# EAGLE design BPW5023 Prototyping Wing (EAGLE 6.3)
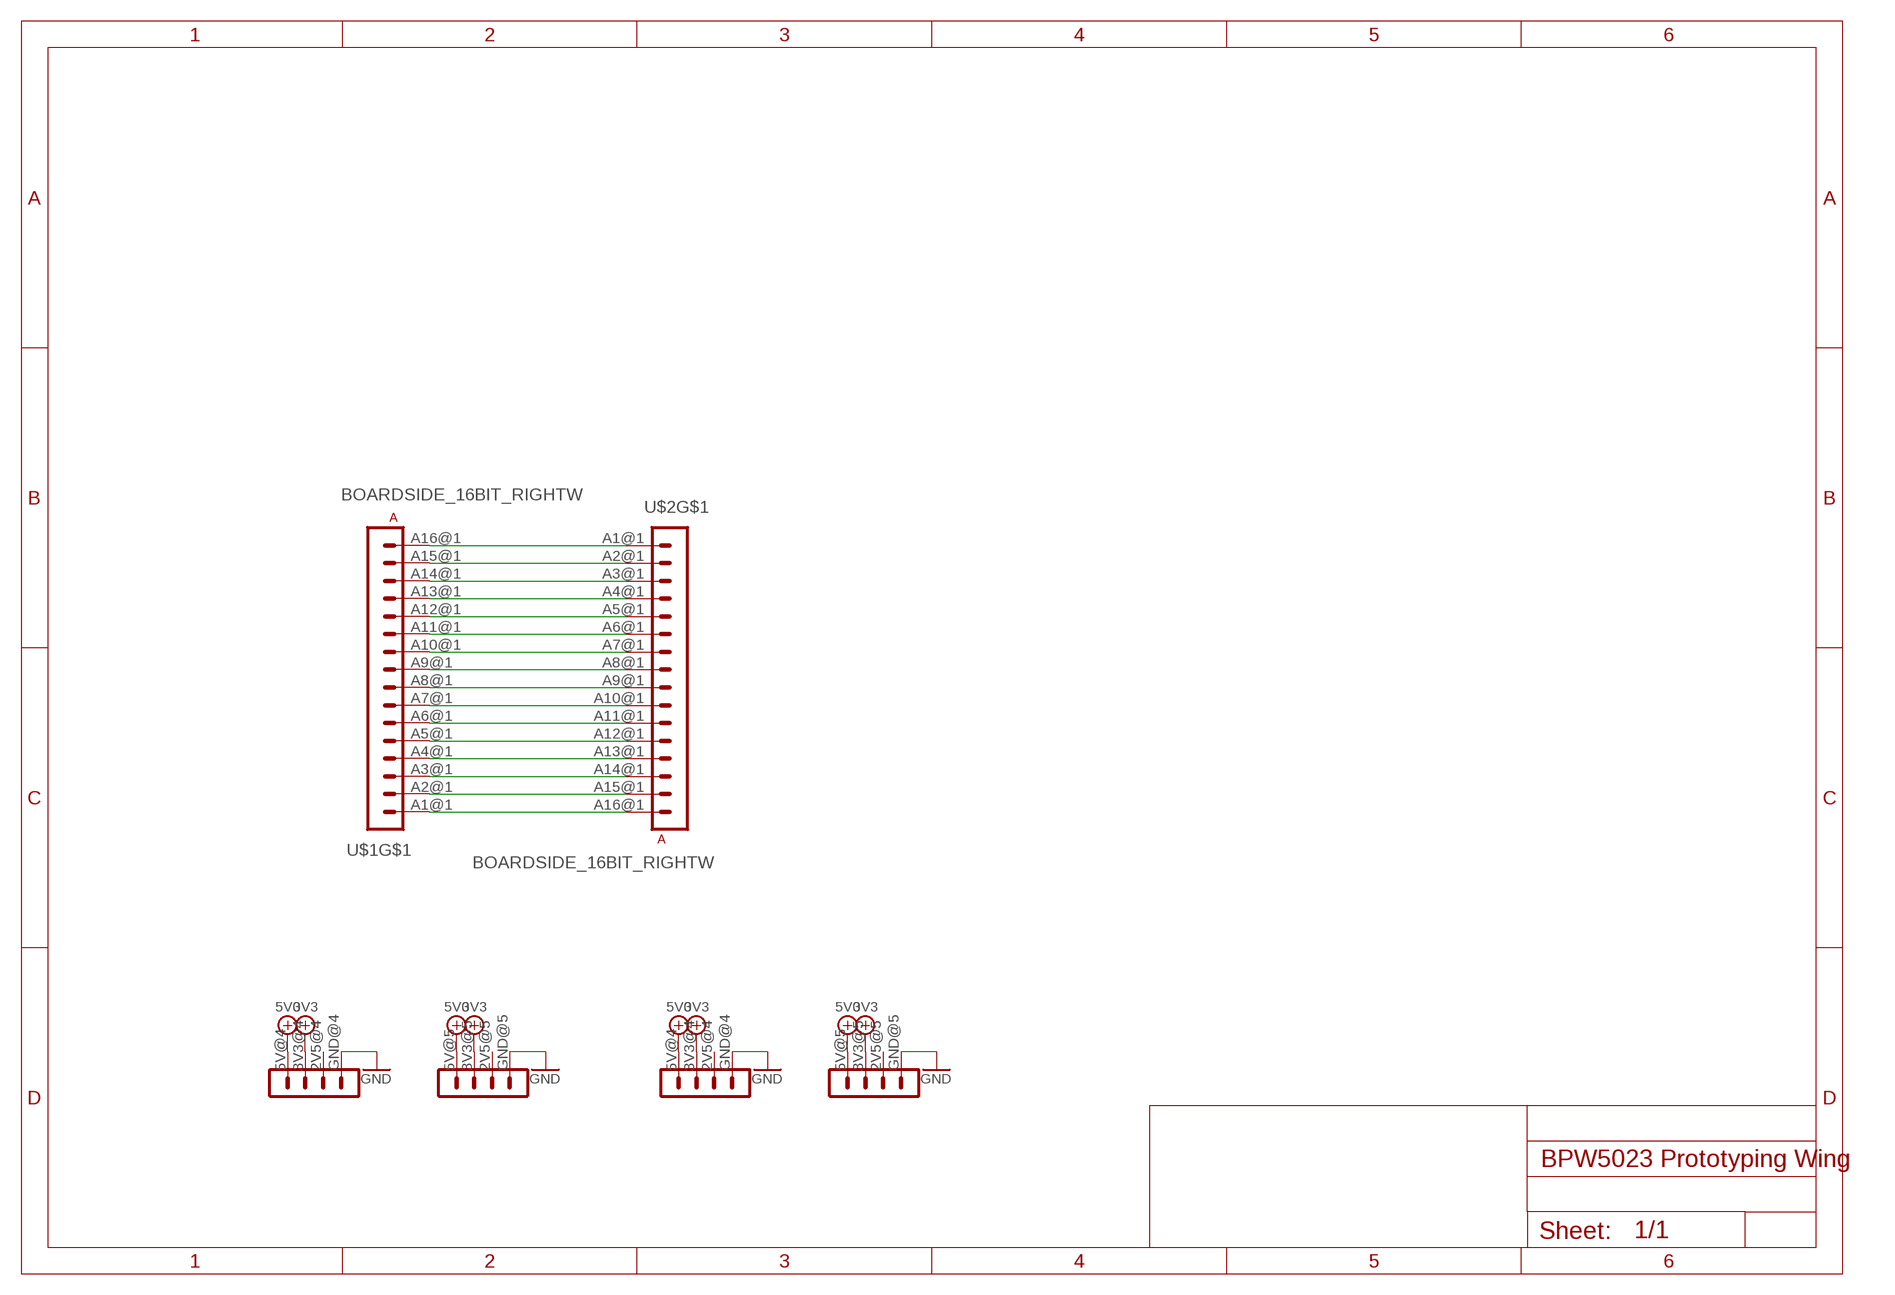
[diagram p0: schematic, sheet 1]

## Parts
U$1  BOARDSIDE_16BIT_RIGHTW  [COCOON_16BIT]
U$2  BOARDSIDE_16BIT_RIGHTW  [COCOON_16BIT]

## Nets
3V3: U$1.3V3@4(3V3) U$1.3V3@5(3V3) U$2.3V3@4(3V3) U$2.3V3@5(3V3)
5V0: U$1.5V@4(5V) U$1.5V@5(5V) U$2.5V@4(5V) U$2.5V@5(5V)
A1: U$1.A1@1(A1) U$2.A16@1(A16)
A2: U$1.A2@1(A2) U$2.A15@1(A15)
A3: U$1.A3@1(A3) U$2.A14@1(A14)
A4: U$1.A4@1(A4) U$2.A13@1(A13)
A5: U$1.A5@1(A5) U$2.A12@1(A12)
A6: U$1.A6@1(A6) U$2.A11@1(A11)
A7: U$1.A7@1(A7) U$2.A10@1(A10)
A8: U$1.A8@1(A8) U$2.A9@1(A9)
A9: U$1.A9@1(A9) U$2.A8@1(A8)
A10: U$1.A10@1(A10) U$2.A7@1(A7)
A11: U$1.A11@1(A11) U$2.A6@1(A6)
A12: U$1.A12@1(A12) U$2.A5@1(A5)
A13: U$1.A13@1(A13) U$2.A4@1(A4)
A14: U$1.A14@1(A14) U$2.A3@1(A3)
A15: U$1.A15@1(A15) U$2.A2@1(A2)
A16: U$1.A16@1(A16) U$2.A1@1(A1)
GND: U$1.GND@4(GND) U$1.GND@5(GND) U$2.GND@4(GND) U$2.GND@5(GND)
Unconnected: U$1.2V5@4(2V5) U$1.2V5@5(2V5) U$2.2V5@4(2V5) U$2.2V5@5(2V5)

## Library data of the parts
U$1 U$2 = GadgetFactory_Pub:BOARDSIDE_16BIT_RIGHT

## Board
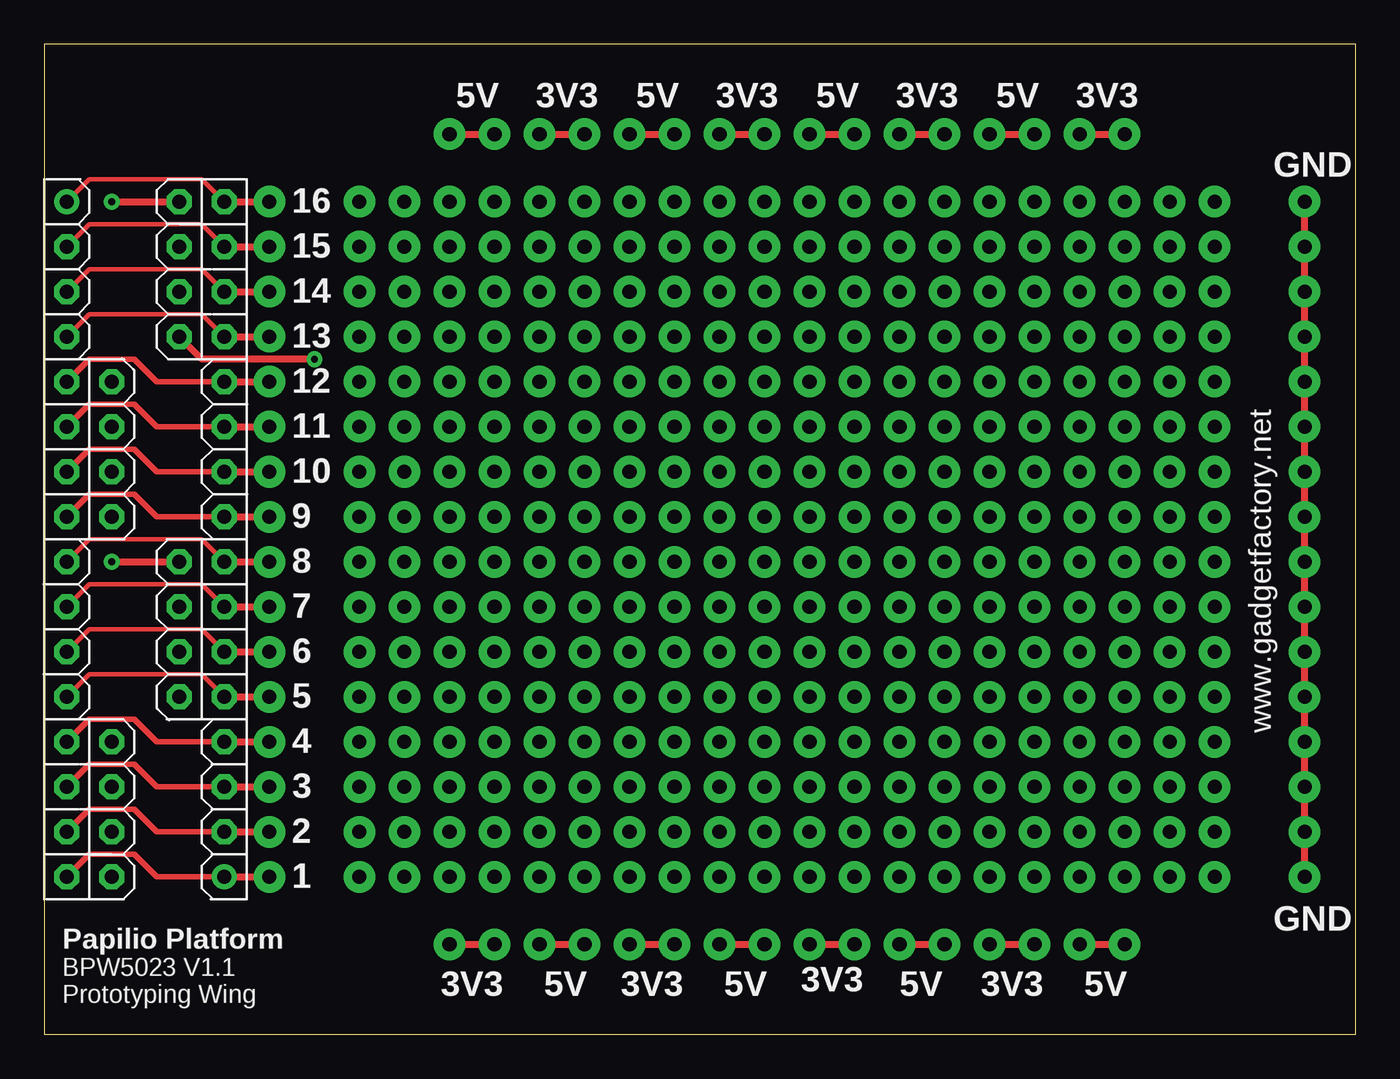
[diagram p1: board, top side]
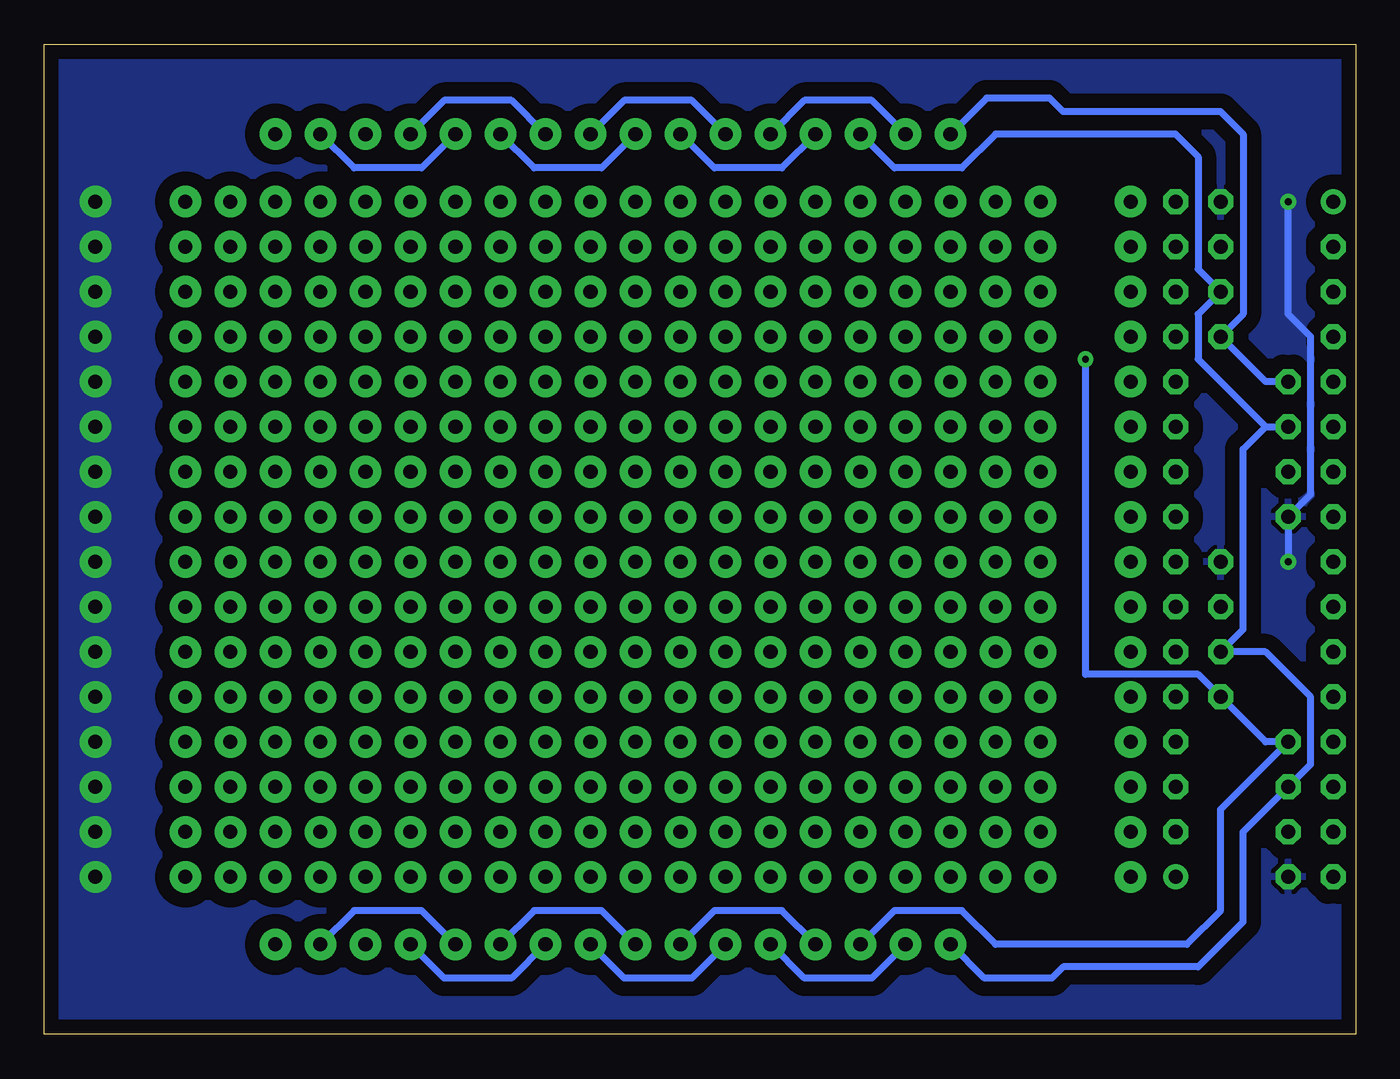
[diagram p2: board, bottom side, seen from below]

Size 74 x 55.87 mm. Coordinates in mm from the lower left corner, seen from the top.
Outline: 0,0 74,0 74,55.87 0,55.87 0,0
Copper layers (1*16): Top 0.035mm / dielectric 1.5mm / Bottom 0.035mm
Design rules "SparkFun_Derived_GoldePheonix_7mil": minimum track width 7mil, minimum drill 15mil, track to track 7mil, track to pad 7mil, pad to pad 7mil, via to via 7mil, smd to smd 7mil, copper to edge 7mil, drill to drill 7mil, minimum pad ring 12mil, minimum via ring 10mil, stop-mask expansion 4mil, vias tented up to drill 18mil, thermal gap 10mil

### Footprints (pad centres in the part's own frame; a part is rotated, then mirrored left to right if it is on the bottom)
COCOON_16BIT = drill 0.8 octagon: 2V5@4 3.81,-16.51; 2V5@5 3.81,3.81; 3V3@4 3.81,-13.97; 3V3@5 3.81,6.35; 5V@4 3.81,-11.43; 5V@5 3.81,8.89; A1@1 1.27,-19.05; A2@1 1.27,-16.51; A3@1 1.27,-13.97; A4@1 1.27,-11.43; A5@1 1.27,-8.89; A6@1 1.27,-6.35; A7@1 1.27,-3.81; A8@1 1.27,-1.27; A9@1 1.27,1.27; A10@1 1.27,3.81; A11@1 1.27,6.35; A12@1 1.27,8.89; A13@1 1.27,11.43; A14@1 1.27,13.97; A15@1 1.27,16.51; GND@4 3.81,-19.05; GND@5 3.81,1.27 | drill 0.8: A16@1 1.27,19.05

### Placement (x,y rotation side)
U$1  0,27.94 0 top
U$2  11.43,27.94 180 top

### Tracks (layer width: path | path; a pad name or v marks a point on that pad's centre or on a via)
3V3  (via drill 0.8 pad 1.78)
  Top 0.406: v58.42,50.8 v60.96,50.8 | v22.86,5.08 v25.4,5.08 | v33.02,5.08 v35.56,5.08 | v43.18,5.08 v45.72,5.08 | v53.34,5.08 v55.88,5.08 | v27.94,50.8 v30.48,50.8 | v38.1,50.8 v40.64,50.8 | v48.26,50.8 v50.8,50.8
  Bottom 0.406: v27.94,50.8 26.04,48.9 22.23,48.9 20.32,50.8 10.16,50.8 8.89,49.53 8.89,43.18 U$2.3V3@4 8.89,40.64 8.89,38.1 5.08,34.29 | v30.48,50.8 32.38,48.9 36.2,48.9 v38.1,50.8 | v40.64,50.8 42.55,48.9 46.35,48.9 v48.26,50.8 | v50.8,50.8 52.7,48.9 56.52,48.9 v58.42,50.8 | v22.86,5.08 20.95,3.17 17.14,3.17 16.51,3.81 8.89,3.81 6.35,6.35 6.35,11.43 U$1.3V3@4 2.54,15.24 2.54,19.05 5.08,21.59 U$2.3V3@5 6.35,22.86 6.35,33.02 5.08,34.29 | v25.4,5.08 27.3,3.17 31.11,3.17 v33.02,5.08 | v35.56,5.08 37.47,3.17 41.27,3.17 v43.18,5.08 | v45.72,5.08 47.62,3.17 51.44,3.17 v53.34,5.08 | 5.08,34.29 U$1.3V3@5
5V0  (via drill 0.38, 0.8 pad 1.78)
  Top 0.406: v22.86,50.8 v25.4,50.8 | v33.02,50.8 v35.56,50.8 | v43.18,50.8 v45.72,50.8 | v53.34,50.8 v55.88,50.8 | v38.1,5.08 v40.64,5.08 | v48.26,5.08 v50.8,5.08 | v58.42,5.08 v60.96,5.08 | v27.94,5.08 v30.48,5.08 | v15.24,38.1 8.89,38.1 U$2.5V@4
  Bottom 0.406: v22.86,50.8 20.83,52.83 17.27,52.83 16.51,52.07 7.62,52.07 6.35,50.8 6.35,40.64 U$2.5V@4 5.08,36.83 U$1.5V@5 | v25.4,50.8 27.3,52.7 31.11,52.7 v33.02,50.8 | v35.56,50.8 37.47,52.7 41.27,52.7 v43.18,50.8 | v45.72,50.8 47.62,52.7 51.44,52.7 v53.34,50.8 | v27.94,5.08 26.04,6.99 22.23,6.99 20.32,5.08 9.53,5.08 7.62,6.99 7.62,12.7 U$1.5V@4 5.08,16.51 U$2.5V@5 8.89,20.32 15.24,20.32 v15.24,38.1 | v30.48,5.08 32.38,6.99 36.2,6.99 v38.1,5.08 | v40.64,5.08 42.55,6.99 46.35,6.99 v48.26,5.08 | v50.8,5.08 52.7,6.99 56.52,6.99 v58.42,5.08
A1  (via drill 0.8 pad 1.78)
  Top 0.305: U$1.A1@1 2.54,10.16 5.08,10.16 6.35,8.89 U$2.A16@1
  Top 0.406: U$2.A16@1 v12.7,8.89
A2  (via drill 0.8 pad 1.78)
  Top 0.305: U$2.A15@1 6.35,11.43 5.08,12.7 2.54,12.7 U$1.A2@1
  Top 0.406: U$2.A15@1 v12.7,11.43
A3  (via drill 0.8 pad 1.78)
  Top 0.305: U$2.A14@1 6.35,13.97 5.08,15.24 2.54,15.24 U$1.A3@1
  Top 0.406: U$2.A14@1 v12.7,13.97
A4  (via drill 0.8 pad 1.78)
  Top 0.305: U$2.A13@1 6.35,16.51 5.08,17.78 2.54,17.78 U$1.A4@1
  Top 0.406: U$2.A13@1 v12.7,16.51
A5  (via drill 0.8 pad 1.78)
  Top 0.254: U$1.A5@1 2.54,20.32 8.89,20.32 U$2.A12@1
  Top 0.406: U$2.A12@1 v12.7,19.05
A6  (via drill 0.8 pad 1.78)
  Top 0.254: U$1.A6@1 2.54,22.86 8.89,22.86 U$2.A11@1
  Top 0.406: U$2.A11@1 v12.7,21.59
A7  (via drill 0.8 pad 1.78)
  Top 0.254: U$1.A7@1 2.54,25.4 8.89,25.4 U$2.A10@1
  Top 0.406: U$2.A10@1 v12.7,24.13
A8  (via drill 0.8 pad 1.78)
  Top 0.254: U$1.A8@1 2.54,27.94 8.89,27.94 U$2.A9@1
  Top 0.406: U$2.A9@1 v12.7,26.67
A9  (via drill 0.8 pad 1.78)
  Top 0.305: U$1.A9@1 2.54,30.48 5.08,30.48 6.35,29.21 U$2.A8@1
  Top 0.406: U$2.A8@1 v12.7,29.21
A10  (via drill 0.8 pad 1.78)
  Top 0.305: U$2.A7@1 6.35,31.75 5.08,33.02 2.54,33.02 U$1.A10@1
  Top 0.406: U$2.A7@1 v12.7,31.75
A11  (via drill 0.8 pad 1.78)
  Top 0.305: U$2.A6@1 6.35,34.29 5.08,35.56 2.54,35.56 U$1.A11@1
  Top 0.406: U$2.A6@1 v12.7,34.29
A12  (via drill 0.8 pad 1.78)
  Top 0.305: U$2.A5@1 6.35,36.83 5.08,38.1 2.54,38.1 U$1.A12@1
  Top 0.406: U$2.A5@1 v12.7,36.83
A13  (via drill 0.8 pad 1.78)
  Top 0.254: U$1.A13@1 2.54,40.64 8.89,40.64 U$2.A4@1
  Top 0.406: U$2.A4@1 v12.7,39.37
A14  (via drill 0.8 pad 1.78)
  Top 0.254: U$1.A14@1 2.54,43.18 8.89,43.18 U$2.A3@1
  Top 0.406: U$2.A3@1 v12.7,41.91
A15  (via drill 0.8 pad 1.78)
  Top 0.254: U$1.A15@1 2.54,45.72 8.89,45.72 U$2.A2@1
  Top 0.406: U$2.A2@1 v12.7,44.45
A16  (via drill 0.8 pad 1.78)
  Top 0.254: U$1.A16@1 2.54,48.26 8.89,48.26 U$2.A1@1
  Top 0.406: U$2.A1@1 v12.7,46.99
GND  (via drill 0.38, 0.8 pad 1.78)
  Top 0.406: v71.12,46.99 v71.12,44.45 v71.12,41.91 v71.12,39.37 v71.12,36.83 v71.12,34.29 v71.12,31.75 v71.12,29.21 v71.12,26.67 v71.12,24.13 v71.12,21.59 v71.12,19.05 v71.12,16.51 v71.12,13.97 v71.12,11.43 v71.12,8.89 | v3.81,46.99 U$2.GND@4 | v3.81,26.67 U$2.GND@5
  Bottom 0.406: v3.81,46.99 3.81,40.64 2.54,39.37 2.54,30.48 U$1.GND@5 v3.81,26.67
  pour Bottom (isolate 0.813): 0,55.88 73.66,55.88 73.66,0 0,0
N$1  (via drill 0.8 pad 1.78)
  other vias: 17.78,8.89
N$2  (via drill 0.8 pad 1.78)
  other vias: 20.32,8.89
N$3  (via drill 0.8 pad 1.78)
  other vias: 22.86,8.89
N$4  (via drill 0.8 pad 1.78)
  other vias: 25.4,8.89
N$5  (via drill 0.8 pad 1.78)
  other vias: 27.94,8.89
N$6  (via drill 0.8 pad 1.78)
  other vias: 30.48,8.89
N$7  (via drill 0.8 pad 1.78)
  other vias: 33.02,8.89
N$8  (via drill 0.8 pad 1.78)
  other vias: 35.56,8.89
N$9  (via drill 0.8 pad 1.78)
  other vias: 38.1,8.89
N$10  (via drill 0.8 pad 1.78)
  other vias: 40.64,8.89
N$11  (via drill 0.8 pad 1.78)
  other vias: 17.78,11.43
N$12  (via drill 0.8 pad 1.78)
  other vias: 20.32,11.43
N$13  (via drill 0.8 pad 1.78)
  other vias: 22.86,11.43
N$14  (via drill 0.8 pad 1.78)
  other vias: 25.4,11.43
N$15  (via drill 0.8 pad 1.78)
  other vias: 27.94,11.43
N$16  (via drill 0.8 pad 1.78)
  other vias: 30.48,11.43
N$17  (via drill 0.8 pad 1.78)
  other vias: 33.02,11.43
N$18  (via drill 0.8 pad 1.78)
  other vias: 35.56,11.43
N$19  (via drill 0.8 pad 1.78)
  other vias: 38.1,11.43
N$20  (via drill 0.8 pad 1.78)
  other vias: 40.64,11.43
N$21  (via drill 0.8 pad 1.78)
  other vias: 40.64,13.97
N$22  (via drill 0.8 pad 1.78)
  other vias: 38.1,13.97
N$23  (via drill 0.8 pad 1.78)
  other vias: 35.56,13.97
N$24  (via drill 0.8 pad 1.78)
  other vias: 33.02,13.97
N$25  (via drill 0.8 pad 1.78)
  other vias: 30.48,13.97
N$26  (via drill 0.8 pad 1.78)
  other vias: 27.94,13.97
N$27  (via drill 0.8 pad 1.78)
  other vias: 25.4,13.97
N$28  (via drill 0.8 pad 1.78)
  other vias: 22.86,13.97
N$29  (via drill 0.8 pad 1.78)
  other vias: 20.32,13.97
N$30  (via drill 0.8 pad 1.78)
  other vias: 17.78,13.97
N$31  (via drill 0.8 pad 1.78)
  other vias: 17.78,16.51
N$32  (via drill 0.8 pad 1.78)
  other vias: 20.32,16.51
N$33  (via drill 0.8 pad 1.78)
  other vias: 22.86,16.51
N$34  (via drill 0.8 pad 1.78)
  other vias: 25.4,16.51
N$35  (via drill 0.8 pad 1.78)
  other vias: 27.94,16.51
N$36  (via drill 0.8 pad 1.78)
  other vias: 30.48,16.51
N$37  (via drill 0.8 pad 1.78)
  other vias: 33.02,16.51
N$38  (via drill 0.8 pad 1.78)
  other vias: 35.56,16.51
N$39  (via drill 0.8 pad 1.78)
  other vias: 38.1,16.51
N$40  (via drill 0.8 pad 1.78)
  other vias: 40.64,16.51
N$41  (via drill 0.8 pad 1.78)
  other vias: 40.64,19.05
N$42  (via drill 0.8 pad 1.78)
  other vias: 38.1,19.05
N$43  (via drill 0.8 pad 1.78)
  other vias: 35.56,19.05
N$44  (via drill 0.8 pad 1.78)
  other vias: 33.02,19.05
N$45  (via drill 0.8 pad 1.78)
  other vias: 30.48,19.05
N$46  (via drill 0.8 pad 1.78)
  other vias: 27.94,19.05
N$47  (via drill 0.8 pad 1.78)
  other vias: 25.4,19.05
N$48  (via drill 0.8 pad 1.78)
  other vias: 22.86,19.05
N$49  (via drill 0.8 pad 1.78)
  other vias: 20.32,19.05
N$50  (via drill 0.8 pad 1.78)
  other vias: 17.78,19.05
N$51  (via drill 0.8 pad 1.78)
  other vias: 17.78,21.59
N$52  (via drill 0.8 pad 1.78)
  other vias: 20.32,21.59
N$53  (via drill 0.8 pad 1.78)
  other vias: 22.86,21.59
N$54  (via drill 0.8 pad 1.78)
  other vias: 25.4,21.59
N$55  (via drill 0.8 pad 1.78)
  other vias: 27.94,21.59
N$56  (via drill 0.8 pad 1.78)
  other vias: 30.48,21.59
N$57  (via drill 0.8 pad 1.78)
  other vias: 33.02,21.59
N$58  (via drill 0.8 pad 1.78)
  other vias: 35.56,21.59
N$59  (via drill 0.8 pad 1.78)
  other vias: 38.1,21.59
N$60  (via drill 0.8 pad 1.78)
  other vias: 40.64,21.59
N$61  (via drill 0.8 pad 1.78)
  other vias: 40.64,24.13
N$62  (via drill 0.8 pad 1.78)
  other vias: 38.1,24.13
N$63  (via drill 0.8 pad 1.78)
  other vias: 35.56,24.13
N$64  (via drill 0.8 pad 1.78)
  other vias: 33.02,24.13
N$65  (via drill 0.8 pad 1.78)
  other vias: 30.48,24.13
N$66  (via drill 0.8 pad 1.78)
  other vias: 27.94,24.13
N$67  (via drill 0.8 pad 1.78)
  other vias: 25.4,24.13
N$68  (via drill 0.8 pad 1.78)
  other vias: 22.86,24.13
N$69  (via drill 0.8 pad 1.78)
  other vias: 20.32,24.13
N$70  (via drill 0.8 pad 1.78)
  other vias: 17.78,24.13
N$71  (via drill 0.8 pad 1.78)
  other vias: 17.78,26.67
N$72  (via drill 0.8 pad 1.78)
  other vias: 20.32,26.67
N$73  (via drill 0.8 pad 1.78)
  other vias: 22.86,26.67
N$74  (via drill 0.8 pad 1.78)
  other vias: 25.4,26.67
N$75  (via drill 0.8 pad 1.78)
  other vias: 27.94,26.67
N$76  (via drill 0.8 pad 1.78)
  other vias: 30.48,26.67
N$77  (via drill 0.8 pad 1.78)
  other vias: 33.02,26.67
N$78  (via drill 0.8 pad 1.78)
  other vias: 35.56,26.67
N$79  (via drill 0.8 pad 1.78)
  other vias: 38.1,26.67
N$80  (via drill 0.8 pad 1.78)
  other vias: 40.64,26.67
N$81  (via drill 0.8 pad 1.78)
  other vias: 40.64,29.21
N$82  (via drill 0.8 pad 1.78)
  other vias: 38.1,29.21
N$83  (via drill 0.8 pad 1.78)
  other vias: 35.56,29.21
N$84  (via drill 0.8 pad 1.78)
  other vias: 33.02,29.21
N$85  (via drill 0.8 pad 1.78)
  other vias: 30.48,29.21
N$86  (via drill 0.8 pad 1.78)
  other vias: 27.94,29.21
N$87  (via drill 0.8 pad 1.78)
  other vias: 25.4,29.21
N$88  (via drill 0.8 pad 1.78)
  other vias: 22.86,29.21
N$89  (via drill 0.8 pad 1.78)
  other vias: 20.32,29.21
N$90  (via drill 0.8 pad 1.78)
  other vias: 17.78,29.21
N$91  (via drill 0.8 pad 1.78)
  other vias: 17.78,31.75
N$92  (via drill 0.8 pad 1.78)
  other vias: 20.32,31.75
N$93  (via drill 0.8 pad 1.78)
  other vias: 22.86,31.75
N$94  (via drill 0.8 pad 1.78)
  other vias: 25.4,31.75
N$95  (via drill 0.8 pad 1.78)
  other vias: 27.94,31.75
N$96  (via drill 0.8 pad 1.78)
  other vias: 30.48,31.75
N$97  (via drill 0.8 pad 1.78)
  other vias: 33.02,31.75
N$98  (via drill 0.8 pad 1.78)
  other vias: 35.56,31.75
N$99  (via drill 0.8 pad 1.78)
  other vias: 38.1,31.75
N$100  (via drill 0.8 pad 1.78)
  other vias: 40.64,31.75
N$101  (via drill 0.8 pad 1.78)
  other vias: 40.64,34.29
N$102  (via drill 0.8 pad 1.78)
  other vias: 38.1,34.29
N$103  (via drill 0.8 pad 1.78)
  other vias: 35.56,34.29
N$104  (via drill 0.8 pad 1.78)
  other vias: 33.02,34.29
N$105  (via drill 0.8 pad 1.78)
  other vias: 30.48,34.29
N$106  (via drill 0.8 pad 1.78)
  other vias: 27.94,34.29
N$107  (via drill 0.8 pad 1.78)
  other vias: 25.4,34.29
N$108  (via drill 0.8 pad 1.78)
  other vias: 22.86,34.29
N$109  (via drill 0.8 pad 1.78)
  other vias: 20.32,34.29
N$110  (via drill 0.8 pad 1.78)
  other vias: 17.78,34.29
N$111  (via drill 0.8 pad 1.78)
  other vias: 17.78,36.83
N$112  (via drill 0.8 pad 1.78)
  other vias: 20.32,36.83
N$113  (via drill 0.8 pad 1.78)
  other vias: 22.86,36.83
N$114  (via drill 0.8 pad 1.78)
  other vias: 25.4,36.83
N$115  (via drill 0.8 pad 1.78)
  other vias: 27.94,36.83
N$116  (via drill 0.8 pad 1.78)
  other vias: 30.48,36.83
N$117  (via drill 0.8 pad 1.78)
  other vias: 33.02,36.83
N$118  (via drill 0.8 pad 1.78)
  other vias: 35.56,36.83
N$119  (via drill 0.8 pad 1.78)
  other vias: 38.1,36.83
N$120  (via drill 0.8 pad 1.78)
  other vias: 40.64,36.83
N$121  (via drill 0.8 pad 1.78)
  other vias: 40.64,39.37
N$122  (via drill 0.8 pad 1.78)
  other vias: 38.1,39.37
N$123  (via drill 0.8 pad 1.78)
  other vias: 35.56,39.37
N$124  (via drill 0.8 pad 1.78)
  other vias: 33.02,39.37
N$125  (via drill 0.8 pad 1.78)
  other vias: 30.48,39.37
N$126  (via drill 0.8 pad 1.78)
  other vias: 27.94,39.37
N$127  (via drill 0.8 pad 1.78)
  other vias: 25.4,39.37
N$128  (via drill 0.8 pad 1.78)
  other vias: 22.86,39.37
N$129  (via drill 0.8 pad 1.78)
  other vias: 20.32,39.37
N$130  (via drill 0.8 pad 1.78)
  other vias: 17.78,39.37
N$131  (via drill 0.8 pad 1.78)
  other vias: 17.78,41.91
N$132  (via drill 0.8 pad 1.78)
  other vias: 20.32,41.91
N$133  (via drill 0.8 pad 1.78)
  other vias: 22.86,41.91
N$134  (via drill 0.8 pad 1.78)
  other vias: 25.4,41.91
N$135  (via drill 0.8 pad 1.78)
  other vias: 27.94,41.91
N$136  (via drill 0.8 pad 1.78)
  other vias: 30.48,41.91
N$137  (via drill 0.8 pad 1.78)
  other vias: 33.02,41.91
N$138  (via drill 0.8 pad 1.78)
  other vias: 35.56,41.91
N$139  (via drill 0.8 pad 1.78)
  other vias: 38.1,41.91
N$140  (via drill 0.8 pad 1.78)
  other vias: 40.64,41.91
N$141  (via drill 0.8 pad 1.78)
  other vias: 40.64,44.45
N$142  (via drill 0.8 pad 1.78)
  other vias: 38.1,44.45
N$143  (via drill 0.8 pad 1.78)
  other vias: 35.56,44.45
N$144  (via drill 0.8 pad 1.78)
  other vias: 33.02,44.45
N$145  (via drill 0.8 pad 1.78)
  other vias: 30.48,44.45
N$146  (via drill 0.8 pad 1.78)
  other vias: 27.94,44.45
N$147  (via drill 0.8 pad 1.78)
  other vias: 25.4,44.45
N$148  (via drill 0.8 pad 1.78)
  other vias: 22.86,44.45
N$149  (via drill 0.8 pad 1.78)
  other vias: 20.32,44.45
N$150  (via drill 0.8 pad 1.78)
  other vias: 17.78,44.45
N$151  (via drill 0.8 pad 1.78)
  other vias: 17.78,46.99
N$152  (via drill 0.8 pad 1.78)
  other vias: 20.32,46.99
N$153  (via drill 0.8 pad 1.78)
  other vias: 22.86,46.99
N$154  (via drill 0.8 pad 1.78)
  other vias: 25.4,46.99
N$155  (via drill 0.8 pad 1.78)
  other vias: 27.94,46.99
N$156  (via drill 0.8 pad 1.78)
  other vias: 30.48,46.99
N$157  (via drill 0.8 pad 1.78)
  other vias: 33.02,46.99
N$158  (via drill 0.8 pad 1.78)
  other vias: 35.56,46.99
N$159  (via drill 0.8 pad 1.78)
  other vias: 38.1,46.99
N$160  (via drill 0.8 pad 1.78)
  other vias: 40.64,46.99
N$171  (via drill 0.8 pad 1.78)
  other vias: 43.18,8.89
N$172  (via drill 0.8 pad 1.78)
  other vias: 45.72,8.89
N$173  (via drill 0.8 pad 1.78)
  other vias: 48.26,8.89
N$174  (via drill 0.8 pad 1.78)
  other vias: 50.8,8.89
N$175  (via drill 0.8 pad 1.78)
  other vias: 53.34,8.89
N$176  (via drill 0.8 pad 1.78)
  other vias: 55.88,8.89
N$177  (via drill 0.8 pad 1.78)
  other vias: 58.42,8.89
N$178  (via drill 0.8 pad 1.78)
  other vias: 60.96,8.89
N$179  (via drill 0.8 pad 1.78)
  other vias: 63.5,8.89
N$180  (via drill 0.8 pad 1.78)
  other vias: 66.04,8.89
N$181  (via drill 0.8 pad 1.78)
  other vias: 43.18,11.43
N$182  (via drill 0.8 pad 1.78)
  other vias: 45.72,11.43
N$183  (via drill 0.8 pad 1.78)
  other vias: 48.26,11.43
N$184  (via drill 0.8 pad 1.78)
  other vias: 50.8,11.43
N$185  (via drill 0.8 pad 1.78)
  other vias: 53.34,11.43
N$186  (via drill 0.8 pad 1.78)
  other vias: 55.88,11.43
N$187  (via drill 0.8 pad 1.78)
  other vias: 58.42,11.43
N$188  (via drill 0.8 pad 1.78)
  other vias: 60.96,11.43
N$189  (via drill 0.8 pad 1.78)
  other vias: 63.5,11.43
N$190  (via drill 0.8 pad 1.78)
  other vias: 66.04,11.43
N$191  (via drill 0.8 pad 1.78)
  other vias: 66.04,13.97
N$192  (via drill 0.8 pad 1.78)
  other vias: 63.5,13.97
N$193  (via drill 0.8 pad 1.78)
  other vias: 60.96,13.97
N$194  (via drill 0.8 pad 1.78)
  other vias: 58.42,13.97
N$195  (via drill 0.8 pad 1.78)
  other vias: 55.88,13.97
N$196  (via drill 0.8 pad 1.78)
  other vias: 53.34,13.97
N$197  (via drill 0.8 pad 1.78)
  other vias: 50.8,13.97
N$198  (via drill 0.8 pad 1.78)
  other vias: 48.26,13.97
N$199  (via drill 0.8 pad 1.78)
  other vias: 45.72,13.97
N$200  (via drill 0.8 pad 1.78)
  other vias: 43.18,13.97
N$201  (via drill 0.8 pad 1.78)
  other vias: 43.18,16.51
N$202  (via drill 0.8 pad 1.78)
  other vias: 45.72,16.51
N$203  (via drill 0.8 pad 1.78)
  other vias: 48.26,16.51
N$204  (via drill 0.8 pad 1.78)
  other vias: 50.8,16.51
N$205  (via drill 0.8 pad 1.78)
  other vias: 53.34,16.51
N$206  (via drill 0.8 pad 1.78)
  other vias: 55.88,16.51
N$207  (via drill 0.8 pad 1.78)
  other vias: 58.42,16.51
N$208  (via drill 0.8 pad 1.78)
  other vias: 60.96,16.51
N$209  (via drill 0.8 pad 1.78)
  other vias: 63.5,16.51
N$210  (via drill 0.8 pad 1.78)
  other vias: 66.04,16.51
N$211  (via drill 0.8 pad 1.78)
  other vias: 66.04,19.05
N$212  (via drill 0.8 pad 1.78)
  other vias: 63.5,19.05
N$213  (via drill 0.8 pad 1.78)
  other vias: 60.96,19.05
N$214  (via drill 0.8 pad 1.78)
  other vias: 58.42,19.05
N$215  (via drill 0.8 pad 1.78)
  other vias: 55.88,19.05
N$216  (via drill 0.8 pad 1.78)
  other vias: 53.34,19.05
N$217  (via drill 0.8 pad 1.78)
  other vias: 50.8,19.05
N$218  (via drill 0.8 pad 1.78)
  other vias: 48.26,19.05
N$219  (via drill 0.8 pad 1.78)
  other vias: 45.72,19.05
N$220  (via drill 0.8 pad 1.78)
  other vias: 43.18,19.05
N$221  (via drill 0.8 pad 1.78)
  other vias: 43.18,21.59
N$222  (via drill 0.8 pad 1.78)
  other vias: 45.72,21.59
N$223  (via drill 0.8 pad 1.78)
  other vias: 48.26,21.59
N$224  (via drill 0.8 pad 1.78)
  other vias: 50.8,21.59
N$225  (via drill 0.8 pad 1.78)
  other vias: 53.34,21.59
N$226  (via drill 0.8 pad 1.78)
  other vias: 55.88,21.59
N$227  (via drill 0.8 pad 1.78)
  other vias: 58.42,21.59
N$228  (via drill 0.8 pad 1.78)
  other vias: 60.96,21.59
N$229  (via drill 0.8 pad 1.78)
  other vias: 63.5,21.59
N$230  (via drill 0.8 pad 1.78)
  other vias: 66.04,21.59
N$231  (via drill 0.8 pad 1.78)
  other vias: 66.04,24.13
N$232  (via drill 0.8 pad 1.78)
  other vias: 63.5,24.13
N$233  (via drill 0.8 pad 1.78)
  other vias: 60.96,24.13
N$234  (via drill 0.8 pad 1.78)
  other vias: 58.42,24.13
N$235  (via drill 0.8 pad 1.78)
  other vias: 55.88,24.13
N$236  (via drill 0.8 pad 1.78)
  other vias: 53.34,24.13
N$237  (via drill 0.8 pad 1.78)
  other vias: 50.8,24.13
N$238  (via drill 0.8 pad 1.78)
  other vias: 48.26,24.13
N$239  (via drill 0.8 pad 1.78)
  other vias: 45.72,24.13
N$240  (via drill 0.8 pad 1.78)
  other vias: 43.18,24.13
N$241  (via drill 0.8 pad 1.78)
  other vias: 43.18,26.67
N$242  (via drill 0.8 pad 1.78)
  other vias: 45.72,26.67
N$243  (via drill 0.8 pad 1.78)
  other vias: 48.26,26.67
N$244  (via drill 0.8 pad 1.78)
  other vias: 50.8,26.67
N$245  (via drill 0.8 pad 1.78)
  other vias: 53.34,26.67
N$246  (via drill 0.8 pad 1.78)
  other vias: 55.88,26.67
N$247  (via drill 0.8 pad 1.78)
  other vias: 58.42,26.67
N$248  (via drill 0.8 pad 1.78)
  other vias: 60.96,26.67
N$249  (via drill 0.8 pad 1.78)
  other vias: 63.5,26.67
N$250  (via drill 0.8 pad 1.78)
  other vias: 66.04,26.67
N$251  (via drill 0.8 pad 1.78)
  other vias: 66.04,29.21
N$252  (via drill 0.8 pad 1.78)
  other vias: 63.5,29.21
N$253  (via drill 0.8 pad 1.78)
  other vias: 60.96,29.21
N$254  (via drill 0.8 pad 1.78)
  other vias: 58.42,29.21
N$255  (via drill 0.8 pad 1.78)
  other vias: 55.88,29.21
N$256  (via drill 0.8 pad 1.78)
  other vias: 53.34,29.21
N$257  (via drill 0.8 pad 1.78)
  other vias: 50.8,29.21
N$258  (via drill 0.8 pad 1.78)
  other vias: 48.26,29.21
N$259  (via drill 0.8 pad 1.78)
  other vias: 45.72,29.21
N$260  (via drill 0.8 pad 1.78)
  other vias: 43.18,29.21
N$261  (via drill 0.8 pad 1.78)
  other vias: 43.18,31.75
N$262  (via drill 0.8 pad 1.78)
  other vias: 45.72,31.75
N$263  (via drill 0.8 pad 1.78)
  other vias: 48.26,31.75
N$264  (via drill 0.8 pad 1.78)
  other vias: 50.8,31.75
N$265  (via drill 0.8 pad 1.78)
  other vias: 53.34,31.75
N$266  (via drill 0.8 pad 1.78)
  other vias: 55.88,31.75
N$267  (via drill 0.8 pad 1.78)
  other vias: 58.42,31.75
N$268  (via drill 0.8 pad 1.78)
  other vias: 60.96,31.75
N$269  (via drill 0.8 pad 1.78)
  other vias: 63.5,31.75
N$270  (via drill 0.8 pad 1.78)
  other vias: 66.04,31.75
N$271  (via drill 0.8 pad 1.78)
  other vias: 66.04,34.29
N$272  (via drill 0.8 pad 1.78)
  other vias: 63.5,34.29
N$273  (via drill 0.8 pad 1.78)
  other vias: 60.96,34.29
N$274  (via drill 0.8 pad 1.78)
  other vias: 58.42,34.29
N$275  (via drill 0.8 pad 1.78)
  other vias: 55.88,34.29
N$276  (via drill 0.8 pad 1.78)
  other vias: 53.34,34.29
N$277  (via drill 0.8 pad 1.78)
  other vias: 50.8,34.29
N$278  (via drill 0.8 pad 1.78)
  other vias: 48.26,34.29
N$279  (via drill 0.8 pad 1.78)
  other vias: 45.72,34.29
N$280  (via drill 0.8 pad 1.78)
  other vias: 43.18,34.29
N$281  (via drill 0.8 pad 1.78)
  other vias: 43.18,36.83
N$282  (via drill 0.8 pad 1.78)
  other vias: 45.72,36.83
N$283  (via drill 0.8 pad 1.78)
  other vias: 48.26,36.83
N$284  (via drill 0.8 pad 1.78)
  other vias: 50.8,36.83
N$285  (via drill 0.8 pad 1.78)
  other vias: 53.34,36.83
N$286  (via drill 0.8 pad 1.78)
  other vias: 55.88,36.83
N$287  (via drill 0.8 pad 1.78)
  other vias: 58.42,36.83
N$288  (via drill 0.8 pad 1.78)
  other vias: 60.96,36.83
N$289  (via drill 0.8 pad 1.78)
  other vias: 63.5,36.83
N$290  (via drill 0.8 pad 1.78)
  other vias: 66.04,36.83
N$291  (via drill 0.8 pad 1.78)
  other vias: 66.04,39.37
N$292  (via drill 0.8 pad 1.78)
  other vias: 63.5,39.37
N$293  (via drill 0.8 pad 1.78)
  other vias: 60.96,39.37
N$294  (via drill 0.8 pad 1.78)
  other vias: 58.42,39.37
N$295  (via drill 0.8 pad 1.78)
  other vias: 55.88,39.37
N$296  (via drill 0.8 pad 1.78)
  other vias: 53.34,39.37
N$297  (via drill 0.8 pad 1.78)
  other vias: 50.8,39.37
N$298  (via drill 0.8 pad 1.78)
  other vias: 48.26,39.37
N$299  (via drill 0.8 pad 1.78)
  other vias: 45.72,39.37
N$300  (via drill 0.8 pad 1.78)
  other vias: 43.18,39.37
N$301  (via drill 0.8 pad 1.78)
  other vias: 43.18,41.91
N$302  (via drill 0.8 pad 1.78)
  other vias: 45.72,41.91
N$303  (via drill 0.8 pad 1.78)
  other vias: 48.26,41.91
N$304  (via drill 0.8 pad 1.78)
  other vias: 50.8,41.91
N$305  (via drill 0.8 pad 1.78)
  other vias: 53.34,41.91
N$306  (via drill 0.8 pad 1.78)
  other vias: 55.88,41.91
N$307  (via drill 0.8 pad 1.78)
  other vias: 58.42,41.91
N$308  (via drill 0.8 pad 1.78)
  other vias: 60.96,41.91
N$309  (via drill 0.8 pad 1.78)
  other vias: 63.5,41.91
N$310  (via drill 0.8 pad 1.78)
  other vias: 66.04,41.91
N$311  (via drill 0.8 pad 1.78)
  other vias: 66.04,44.45
N$312  (via drill 0.8 pad 1.78)
  other vias: 63.5,44.45
N$313  (via drill 0.8 pad 1.78)
  other vias: 60.96,44.45
N$314  (via drill 0.8 pad 1.78)
  other vias: 58.42,44.45
N$315  (via drill 0.8 pad 1.78)
  other vias: 55.88,44.45
N$316  (via drill 0.8 pad 1.78)
  other vias: 53.34,44.45
N$317  (via drill 0.8 pad 1.78)
  other vias: 50.8,44.45
N$318  (via drill 0.8 pad 1.78)
  other vias: 48.26,44.45
N$319  (via drill 0.8 pad 1.78)
  other vias: 45.72,44.45
N$320  (via drill 0.8 pad 1.78)
  other vias: 43.18,44.45
N$321  (via drill 0.8 pad 1.78)
  other vias: 43.18,46.99
N$322  (via drill 0.8 pad 1.78)
  other vias: 45.72,46.99
N$323  (via drill 0.8 pad 1.78)
  other vias: 48.26,46.99
N$324  (via drill 0.8 pad 1.78)
  other vias: 50.8,46.99
N$325  (via drill 0.8 pad 1.78)
  other vias: 53.34,46.99
N$326  (via drill 0.8 pad 1.78)
  other vias: 55.88,46.99
N$327  (via drill 0.8 pad 1.78)
  other vias: 58.42,46.99
N$328  (via drill 0.8 pad 1.78)
  other vias: 60.96,46.99
N$329  (via drill 0.8 pad 1.78)
  other vias: 63.5,46.99
N$348  (via drill 0.8 pad 1.78)
  other vias: 66.04,46.99

### Text on the board
tPlace: 5V | 3V3 | 5V | 3V3 | 5V | 3V3 | 5V | 3V3 | GND | 16 | 15 | 14 | 13 | 12 | 11 | 10 | 9 | 8 | 7 | 6 | 5 | www.gadgetfactory.net | 4 | 3 | 2 | 1 | GND | Papilio Platform | BPW5023 V1.1 | Prototyping Wing | 3V3 | 5V | 3V3 | 5V | 3V3 | 5V | 3V3 | 5V